# Altium schematic sheet Sheet1.SchDoc
size A4; SheetNumber: 1; SheetTotal: 1; SPICEModelCacheHSNNAYIC: <root> / <DocumentId>HSNNAYIC</DocumentId> / </root>
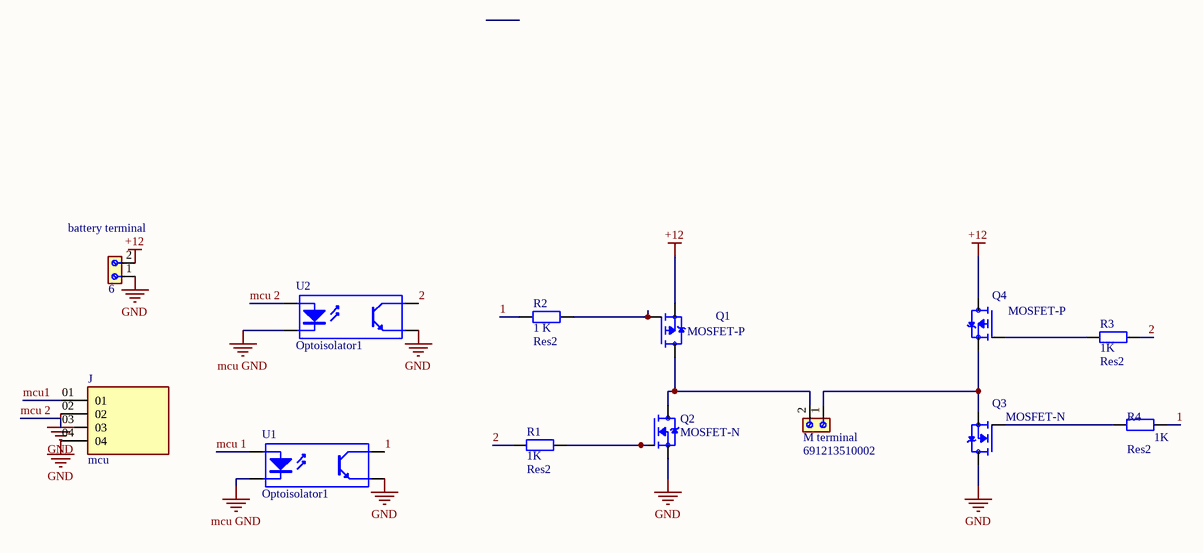
[diagram p0: Sheet1.SchDoc]

## Parts
battery_terminal  6  [691213510002]
J  mcu  [SAMTEC_TSW-104-24-G-S]
M_terminal  691213510002  [691213510002]
Q1  MOSFET-P  [TO545P2000X491X2918-3]
Q2  MOSFET-N  [TO254P1036X470X1965-3]
Q3  MOSFET-N  [TO254P1036X470X1965-3]
Q4  MOSFET-P  [TO545P2000X491X2918-3]
R1  Res2  value 1K  [AXIAL-0.4]
R2  Res2  value 1 K  [AXIAL-0.4]
R3  Res2  value 1K  [AXIAL-0.4]
R4  Res2  value 1K  [AXIAL-0.4]
U1  Optoisolator1  [DIP-4]
U2  Optoisolator1  [DIP-4]

## Nets
+12: battery_terminal.2 Q1.2(S) Q4.3(D)
GND: battery_terminal.1 J.02 J.04 Q2.3(S) Q3.2(D) U1.3(E) U2.3(E)
mcu GND: U1.2(K) U2.2(K)
1: R2.2 R4.2 U1.4(C)
2: R1.1 R3.2 U2.4(C)
mcu1: J.01
mcu 1: U1.1(A)
mcu 2: J.03 U2.1(A)
NetM_terminal_1: M_terminal.1 Q3.3(S) Q4.2(S)
NetM_terminal_2: M_terminal.2 Q1.3(D) Q2.2(D)
NetQ1_1: Q1.1(G) R2.1
NetQ2_1: Q2.1(G) R1.2
NetQ3_1: Q3.1(G) R4.1
NetQ4_1: Q4.1(G) R3.1

## Library data of the parts
battery_terminal M_terminal = 691213510002: 2 Position Wire to Board Terminal Block Horizontal with Board 0.200 (5.08mm) Through Hole; MF: Wurth Electronics; SnapEDA_Link: https://www.snapeda.com/parts/691213510002/Wurth+Electronics/view-part/?ref=snap; Package: None; Value: *; MP: 691213510002; Check_prices: https://www.snapeda.com/parts/691213510002/Wurth+Electronics/view-part/?ref=eda
J = TSW-104-24-G-S: Connector Header Through Hole 4 position 0.100 (2.54mm); MF: Samtec; Price: None; Availability: Unavailable; Package: None; MP: TSW-104-24-G-S; Value: *; SnapEDA_Link: https://www.snapeda.com/parts/TSW-104-24-G-S/Samtec/view-part/3451889/?ref=snap
Q1 Q4 = ECW20P20: P CHANNEL LATERAL MOSFET; Package: None; Price: None; Value: *; MP: ECW20P20; Availability: Unavailable
Q2 Q3 = CSD19503KCS: 80-V, N channel NexFETâ„¢ power MOSFET, single TO-220, 9.2 mOhm; MF: Texas Instruments; SnapEDA_Link: https://www.snapeda.com/parts/CSD19503KCS/Texas+Instruments/view-part/?ref=snap; Package: TO-220-3 Texas Instruments; MP: CSD19503KCS; Check_prices: https://www.snapeda.com/parts/CSD19503KCS/Texas+Instruments/view-part/?ref=eda; Purchase-URL: https://pricing.snapeda.com/search/part/CSD19503KCS/?ref=eda; Price: None; Value: *; Availability: In Stock
R1-R4 = Res2: Resistor; Published: 8-Jun-2000; LatestRevisionDate: 17-Jul-2002; LatestRevisionNote: Re-released for DXP Platform.; PackageReference: AXIAL-0.4; Publisher: Altium Limited; PackageDescription: Axial Device, Thru-Hole; 2 Leads; 0.4 in Pin Spacing
U1 U2 = Optoisolator1: 4-Pin Phototransistor Optocoupler; Published: 24-Mar-1999; LatestRevisionDate: 04-Mar-2005; LatestRevisionNote: Sch pins 3 & 4 Swapped.; DatasheetVersion: Nov-2003; PackageReference: DIP-4; Publisher: Altium Limited